# Altium schematic sheet Fonte_zr_obc.SchDoc
size A4
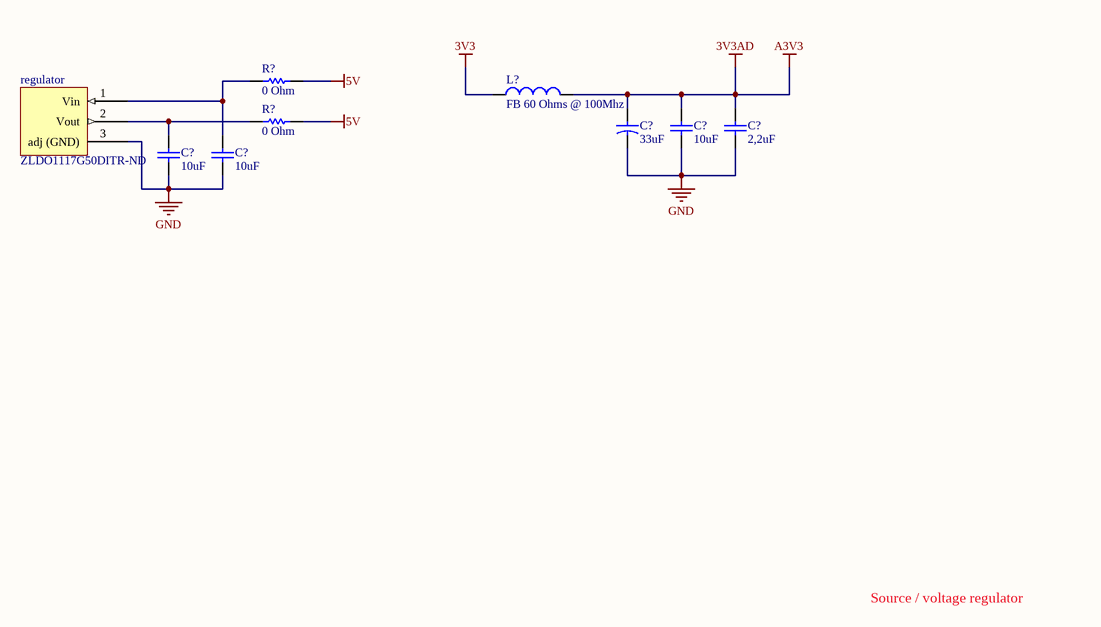
[diagram p0: Fonte_zr_obc.SchDoc]

## Parts
(Parts that share a designator on the sheet are numbered #1, #2 ... from top to bottom, then left to right.)
C?#1  33uF  [CC3216-1206]
C?#2  10uF  [CC1005-0402]
C?#3  2,2uF  [CC1005-0402]
C?#4  10uF  [CC1005-0402]
C?#5  10uF  [CC1005-0402]
L?  FB 60 Ohms @ 100Mhz  [IND_VLF3012]
R?#1  0 Ohm  [CR1005-0402_NP]
R?#2  0 Ohm  [CR1005-0402_NP]
regulator  ZLDO1117G50DITR-ND

## Nets
3V3: L?.1
3V3AD: C?#1.1 C?#2.2 C?#3.2 L?.2  [also labelled A3V3]
5V: R?#1.1 R?#2.1
GND: C?#1.2 C?#2.1 C?#3.1 C?#4.1 C?#5.1 regulator.3(adj_(GND))
NetC?#4_2: C?#4.2 R?#2.2 regulator.2(Vout)
NetC?#5_2: C?#5.2 R?#1.2 regulator.1(Vin)

## Notes on the sheet
- Source / voltage regulator

## Library data of the parts
C?#1 = Capacitor_Tan: Capacitor Tantalum; eVendor: *; eVendorPart#: *; Part#: *; eVendorPrice: *; MOQ: *; Manufacturer: *; MSRP: *
C?#2-C?#5 = Capacitor: eVendor: *; eVendor Price: *; eVendor Part#: *; Manufacturer: *; Part#: *; MOQ: *; MSRP: *; NP: NP
L? = Inductor: eVendor: *; eVendor Price: *; Part#: *; MOQ: *; Manufacturer: *; MSRP: *; eVendor Part#: *; NP: NP
R?#1 R?#2 = Resistor: eVendor: *; eVendor Price: *; Manufacturer: *; MSRP: *; MOQ: *; Part#: *; NP: NP
regulator = dropout_linear_regulator: Manufacturer: Diodes Incorporated; eVendor: Digikey; eVendeor Price: 0.50000; MSRP: 0.24926; eVendor Part#: ZLDO1117G50DITR-ND; MOQ: 500